# Altium schematic sheet MCU.SchDoc
size B
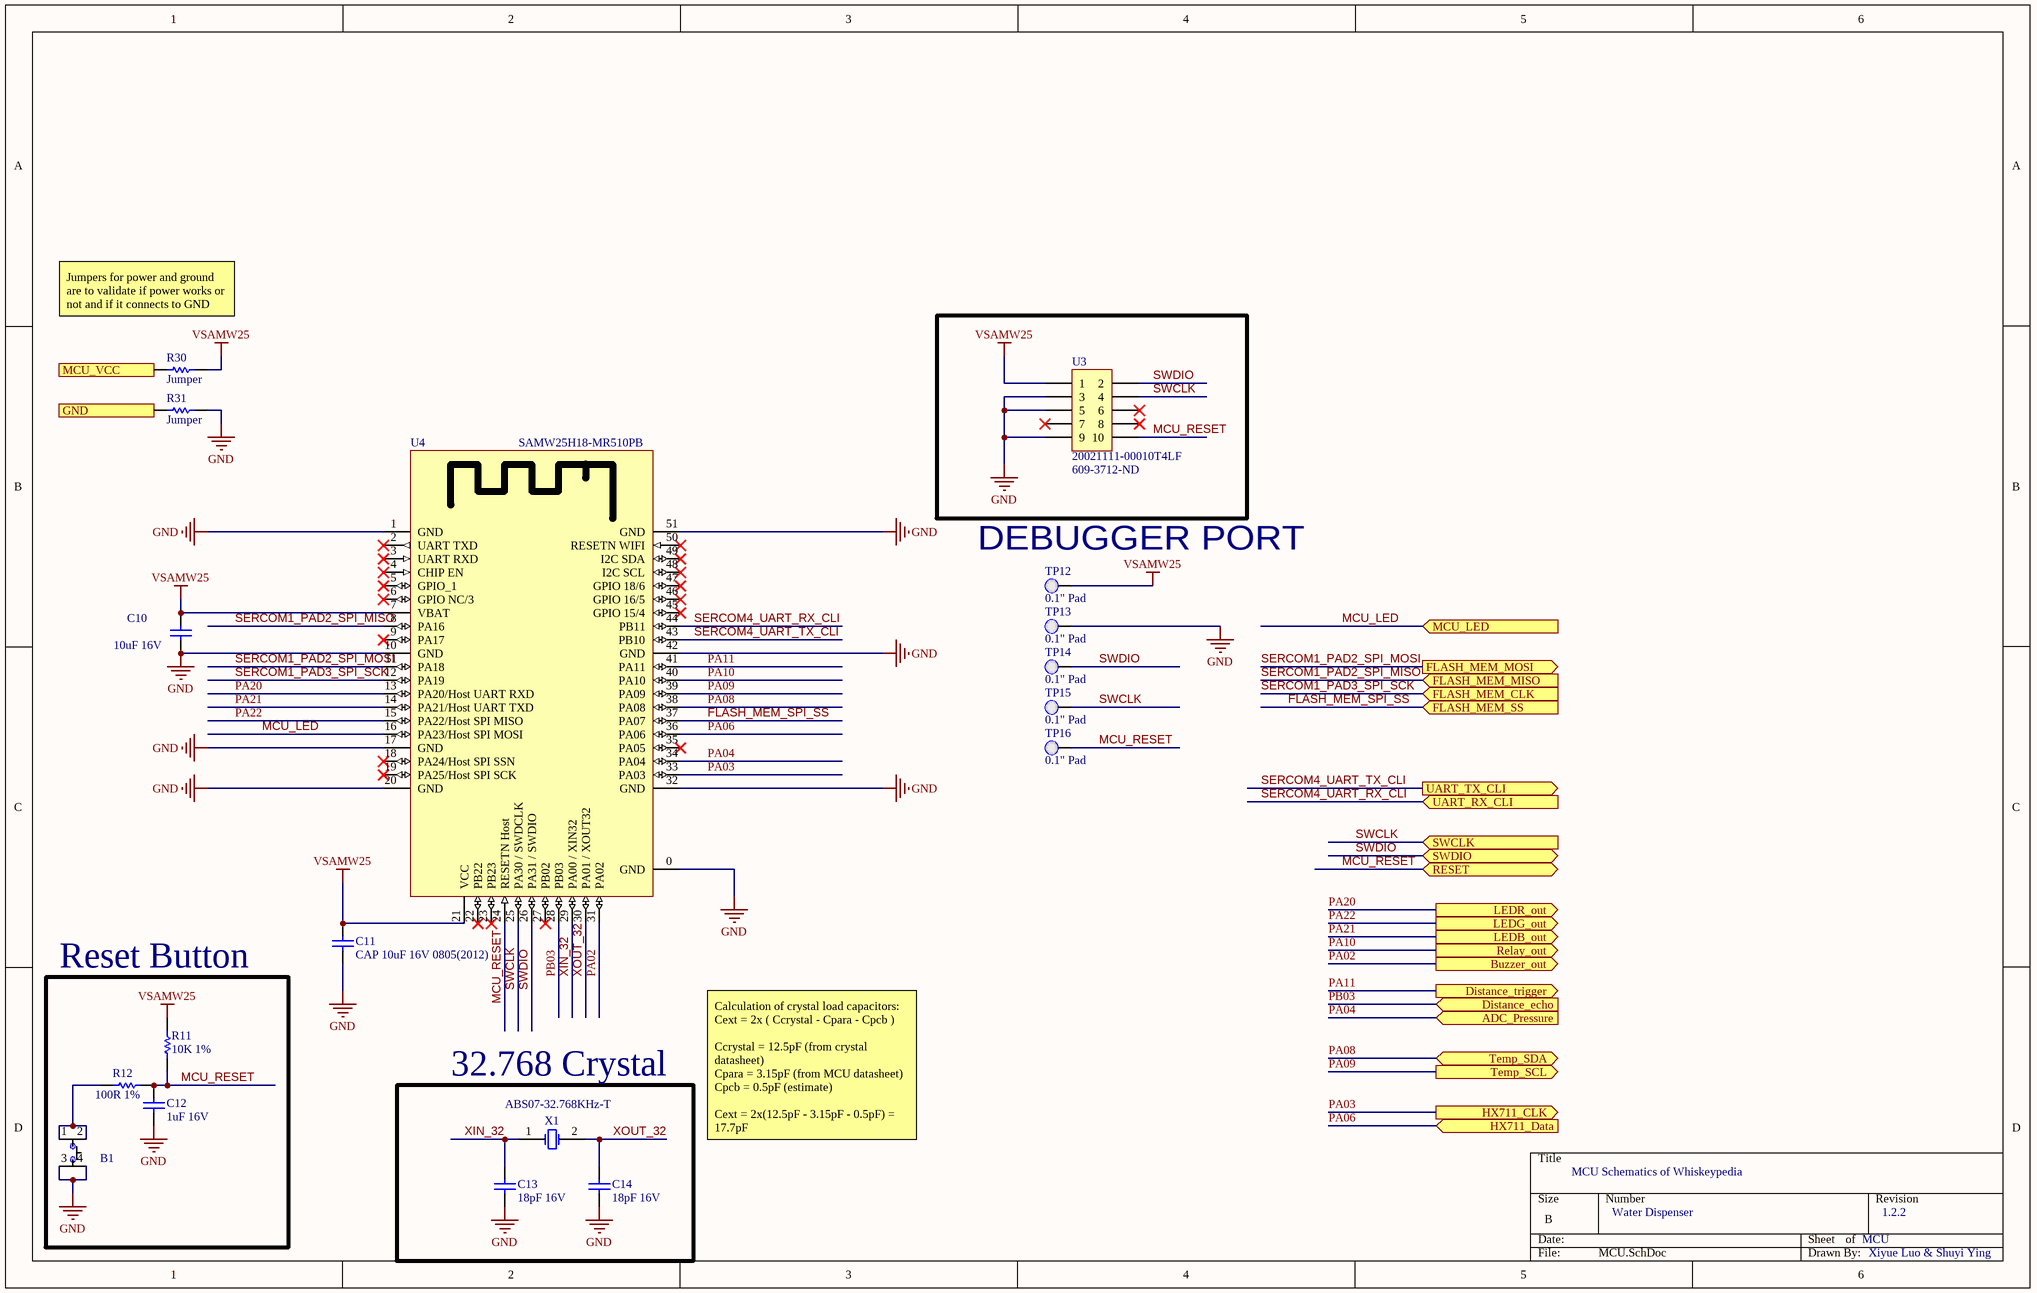
[diagram p0: MCU.SchDoc]

## Parts
B1  PTS810 SJK 250 SMTR LFS  [PTS810 SJK 250 SMTR LFS]  (value not drawn)
C10  10uF 16V  [CAPC0805(2012)145_N]
C11  CAP 10uF 16V 0805(2012)  [CAPC0805(2012)145_N]
C12  1uF 16V  [CAPC0603(1608)100_N]
C13  18pF 16V  [CAPC0603(1608)100_N]
C14  18pF 16V  [CAPC0603(1608)100_N]
R11  10K 1%  [RESC0603(1608)_N]
R12  100R 1%  [RESC0603(1608)_N]
R30  Jumper  [RESC0805(2012)_N]
R31  Jumper  [RESC0805(2012)_N]
TP12  0.1" Pad  [PCBComponent]  (no BOM)
TP13  0.1" Pad  [PCBComponent]  (no BOM)
TP14  0.1" Pad  [PCBComponent]  (no BOM)
TP15  0.1" Pad  [PCBComponent]  (no BOM)
TP16  0.1" Pad  [PCBComponent]  (no BOM)
U3  20021111-00010T4LF  Supplier Part Number 1: 609-3712-ND  [20021111-00010T4LF]
U4  SAMW25H18-MR510PB  [SAMW25H18-MR510PB]
X1  ABS07-32.768KHz-T  [ABRA-ABS07-2_V]

## Blocks framed on the sheet
Reset Button: B1 C12 R11 R12
32.768 Crystal: C13 C14 X1

## Ports
ADC_Pressure (in), Buzzer_out (out), Distance_echo (in), Distance_trigger (out), FLASH_MEM_CLK (in), FLASH_MEM_MISO (in), FLASH_MEM_MOSI (out), FLASH_MEM_SS (in), GND, HX711_CLK (out), HX711_Data (in), LEDB_out (out), LEDG_out (out), LEDR_out (out), MCU_LED (in), MCU_VCC, Relay_out (out), RESET (bidir), SWCLK (in), SWDIO (bidir), Temp_SCL (out), Temp_SDA (bidir), UART_RX_CLI (in), UART_TX_CLI (out)

## Nets
GND: B1.3 B1.4 C10.1 C11.1 C12.1 C13.1 C14.1 R31.2 TP13.1(PAD) U3.3 U3.5 U3.9 U4.0(GND) U4.1(GND) U4.10(GND) U4.17(GND) U4.20(GND) U4.32(GND) U4.42(GND) U4.51(GND)
VSAMW25: C10.2 C11.2 R11.2 R30.2 TP12.1(PAD) U3.1 U4.7(VBAT) U4.21(VCC)
FLASH_MEM_SPI_SS: U4.37(PA07) ; port FLASH_MEM_SS
GND: R31.1 ; port GND  [a separate net that carries the same name]
MCU_LED: U4.16(PA23/Host_SPI_MOSI) ; port MCU_LED
MCU_RESET: C12.2 R11.1 R12.2 TP16.1(PAD) U3.10 U4.24(RESETN_Host) ; port RESET
MCU_VCC: R30.1 ; port MCU_VCC
PA02: U4.31(PA02) ; port Buzzer_out
PA03: U4.33(PA03) ; port HX711_CLK
PA04: U4.34(PA04) ; port ADC_Pressure
PA06: U4.36(PA06) ; port HX711_Data
PA08: U4.38(PA08) ; port Temp_SDA
PA09: U4.39(PA09) ; port Temp_SCL
PA10: U4.40(PA10) ; port Relay_out
PA11: U4.41(PA11) ; port Distance_trigger
PA20: U4.13(PA20/Host_UART_RXD) ; port LEDR_out
PA21: U4.14(PA21/Host_UART_TXD) ; port LEDB_out
PA22: U4.15(PA22/Host_SPI_MISO) ; port LEDG_out
PB03: U4.28(PB03) ; port Distance_echo
SERCOM1_PAD2_SPI_MISO: U4.8(PA16) ; port FLASH_MEM_MISO
SERCOM1_PAD2_SPI_MOSI: U4.11(PA18) ; port FLASH_MEM_MOSI
SERCOM1_PAD3_SPI_SCK: U4.12(PA19) ; port FLASH_MEM_CLK
SERCOM4_UART_RX_CLI: U4.44(PB11) ; port UART_RX_CLI
SERCOM4_UART_TX_CLI: U4.43(PB10) ; port UART_TX_CLI
SWCLK: TP15.1(PAD) U3.4 U4.25(PA30_/_SWDCLK) ; port SWCLK
SWDIO: TP14.1(PAD) U3.2 U4.26(PA31_/_SWDIO) ; port SWDIO
XIN_32: C13.2 U4.29(PA00_/_XIN32) X1.1(X1)
XOUT_32: C14.2 U4.30(PA01_/_XOUT32) X1.2(X2)
NetB1_1: B1.1 B1.2 R12.1

Not connected (* = marked no-connect by the designer): U3 6* 7* 8*; U4 2(UART_TXD)* 3(UART_RXD)* 4(CHIP_EN)* 5(GPIO_1)* 6(GPIO_NC/3)* 9(PA17)* 18(PA24/Host_SPI_SSN)* 19(PA25/Host_SPI_SCK)* 22(PB22)* 23(PB23)* 27(PB02)* 35(PA05)* 45(GPIO_15/4)* 46(GPIO_16/5)* 47(GPIO_18/6)* 48(I2C_SCL)* 49(I2C_SDA)* 50(RESETN_WIFI)*

## Notes on the sheet
- Jumpers for power and ground are to validate if power works or not and if it connects to GND
- (near TP12) DEBUGGER PORT
- Calculation of crystal load capacitors:
  Cext = 2x ( Ccrystal - Cpara - Cpcb )
  Ccrystal = 12.5pF (from crystal datasheet)
  Cpara = 3.15pF (from MCU datasheet)
  Cpcb = 0.5pF (estimate)
  Cext = 2x(12.5pF - 3.15pF - 0.5pF) = 17.7pF
- MCU Schematics of Whiskeypedia
- Water Dispenser
- MCU
- 1.2.2
- Xiyue Luo & Shuyi Ying

## Library data of the parts
B1 = PTS810 SJK 250 SMTR LFS: SWITCH TACTILE SPST-NO 0.05A 16V Tactile Switch SPST-NO Top Actuated Surface Mount; Manufacturer: ITT /  C&K Components; Part # Aliases: Y97LT25B5DBFP; Operating Force: 2.6 N; Actuator: Oval; Current Rating: 50 mA; Voltage Rating DC: 16 VDC; Contact Form: SPST; Switch Function: OFF - (ON); Mounting Direction: Straight; Stem Height: 2.5 mm; Brand: C&K Components; Travel: 0.15 mm; Manufacturer Part Number: PTS810SJK250SMTRLFS; Product Category: Tactile Switches; RoHS: Details; Termination Style: J Form Lead; Mounting Style: SMD/SMT; Color: White; Packaging: Reel; Contact Plating: Silver; Operating Temperature Range: - 40 C to + 85 C; Series: PTS810; Factory Pack Quantity: 2900; ComponentLink1URL: https://datasheet.ciiva.com/18514/pts810-4mar13-18514061.pdf; ComponentLink1Description: https://datasheet.ciiva.com/18514/pts810-4mar13-18514061.pdf; ComponentLink2URL: https://datasheet.ciiva.com/18514/pts810-4mar13-18514062.pdf; ComponentLink2Description: https://datasheet.ciiva.com/18514/pts810-4mar13-18514062.pdf; ComponentLink3URL: https://datasheet.ciiva.com/18514/pts810-4mar13-18514063.pdf; ComponentLink3Description: https://datasheet.ciiva.com/18514/pts810-4mar13-18514063.pdf; Supplier 1: Digi-Key; Supplier Part Number 1: CKN10503CT-ND
C10 C11 = CMP-1036-04927-1: CAP 10uF 16V ±10% 0805 (2012 Metric) Thickness 1.45mm SMD; Case-EIA: 0805; Tolerance: Â±10%; Case-Metric: 2012; Rated Voltage: 16 V; Technology: SMT; Value: 10uF; Max Thickness: 1.45 mm
C12 = CMP-1035-02736-1: CAP 1uF 16V ±5% 0603 (1608 Metric) Thickness 1mm SMD; Case-Metric: 1608; Case-EIA: 0603; Tolerance: Â±5%; Technology: SMT; Max Thickness: 1 mm; Rated Voltage: 16 V; Value: 1uF
C13 C14 = CMP-1035-00738-1: CAP 18pF 16V ±5% 0603 (1608 Metric) Thickness 1mm SMD; Tolerance: Â±5%; Case-EIA: 0603; Case-Metric: 1608; Max Thickness: 1 mm; Rated Voltage: 16 V; Value: 18pF; Technology: SMT
R11 = CMP-1012-00623-1: 10K 0.1W 1% 0603 (1608 Metric)  SMD; Value: 10000.00 Ohm; Case-EIA: 0603; Case-Metric: 1608; Power: 0.1 W; Tolerance: 1 %; Technology: SMT
R12 = CMP-1012-00397-1: 100R 0.1W 1% 0603 (1608 Metric)  SMD; Value: 100.00 Ohm; Case-EIA: 0603; Case-Metric: 1608; Technology: SMT; Tolerance: 1 %; Power: 0.1 W
R30 R31 = CMP-1013-00001-1: Jumper 0805 (2012 Metric); Case-EIA: 0805; Value: 0.00 Ohm; Tolerance: None; Case-Metric: 2012; Technology: SMT; Power: None
TP12-TP16 = 0.1" Pad-A.4
U3 = 20021111-00010T4LF: CONN HEADER 10POS UNSHD VERT T/H; Manufacturer: Amphenol / FCI; Stack Height: 2.5 mm; Number of Positions / Contacts: 10; Brand: FCI; Pitch: 1.27 mm; Mounting Angle: Vertical; Current Rating: 10 A; Mating Post Length: 3.05 mm; Voltage Rating: 125 V; Manufacturer Part Number: 20021111-00010T4LF; Mounting Style: Through Hole; Product Category: Headers & Wire Housings; RoHS: Details; Series: Minitek; Product Type: Headers; Type: Unshrouded; Number of Positions: 10; Number of Rows: 2; Contact Plating: Gold; Housing Material: Plastic; Termination Style: Through Hole; Contact Material: Nickel; Packaging: Tube; Factory Pack Quantity: 93; Termination Post Length: 2.3 mm; ComponentLink1URL: https://datasheet.ciiva.com/1433/1079612-1433267.pdf; ComponentLink1Description: https://datasheet.ciiva.com/1433/1079612-1433267.pdf; ComponentLink2URL: https://datasheet.ciiva.com/409/20021111-409158.pdf; ComponentLink2Description: https://datasheet.ciiva.com/409/20021111-409158.pdf; ComponentLink3URL: https://datasheet.ciiva.com/5131/20021111-5131386.pdf; ComponentLink3Description: https://datasheet.ciiva.com/5131/20021111-5131386.pdf; ComponentLink4URL: https://datasheet.ciiva.com/9465/20021111-9465402.pdf; ComponentLink4Description: https://datasheet.ciiva.com/9465/20021111-9465402.pdf; Supplier 1: Digi-Key
U4 = SAMW25H18-MR510PB: RF TXRX MODULE WIFI TRACE ANT; Manufacturer: Atmel; Manufacturer Part Number: ATSAMW25H18-MR510PB; Protocol: 802.11b/g/n; Frequency: 2.4GHz; Data Rate: 65Mbps; Power - Output: 17dBm; Sensitivity: -95.5dBm; Serial Interfaces: SPI, UART; Antenna Type: Integrated, Trace; Memory Size: 256kB Flash, 32kB SRAM; Voltage - Supply: 2.7 V ~ 4.2 V; Category: RF/IF and RFID; Family: RF Transceiver Modules; Series: Xplained Pro; Packaging: Tray; RF Family/Standard: WiFi; Modulation: -; Current - Receiving: -; Current - Transmitting: -; Mounting Type: Surface Mount; Operating Temperature: -40°C ~ 85°C; Package / Case: Module; ComponentLink1URL: http://www.atmel.com/devices/ATSAMW25.aspx; ComponentLink1Description: http://www.atmel.com/devices/ATSAMW25.aspx; ComponentLink2URL: http://www.farnell.com/datasheets/1965115.pdf; ComponentLink2Description: http://www.farnell.com/datasheets/1965115.pdf; Supplier 1: Digikey; Stock 1: 120; Pricing 1: 1=19.14 (USD); Supplier Part Number 1: ATSAMW25H18-MR510PB-ND
X1 = CMP-0447-00001-2: Crystal, 32.768 kHz, 12.5 pF, -40 to 85 degC, SMD Low Profile 3.2 x 1.5 x 0.9 mm, Tape and Reel; Manufacturer: Abracon; Q Value (Type): 30000; Operation Mode: Flexural Mode (Tuning Fork); Shunt Capacitance (C0): 0.9 to 1.2 pF; Load Capacitance (CL): 12.5 pF; Frequency Tolerance @+25degC: +/- 20 ppm; Drive Level (Type): 0.1 uW; Equivalent Series Resistance (R1): 70 Kohm; Insulation Resistance (Min): 500 Mohm; ComponentLink3URL: http://www.abracon.com/Resonators/ABS07.pdf; PackageDescription: 2-Pin Hand Drawn, Body 3.2x1.5mm, Pitch 2.5mm; Operating Temperature: -40 to 85 degC; ComponentLink2URL: http://www.abracon.com/Resonators/ABS07.pdf; PackageReference: ABS07-2; ComponentLink3Description: Package Specification; ComponentLink1Description: Manufacturer URL; DatasheetVersion: 04.03.13; Mounting Technology: Surface Mount; ComponentLink2Description: Datasheet; ComponentLink1URL: http://www.abracon.com/; PartNumber: ABS07-32.768KHz-T; Packing: Tape and Reel; Frequency: 32.768 kHz